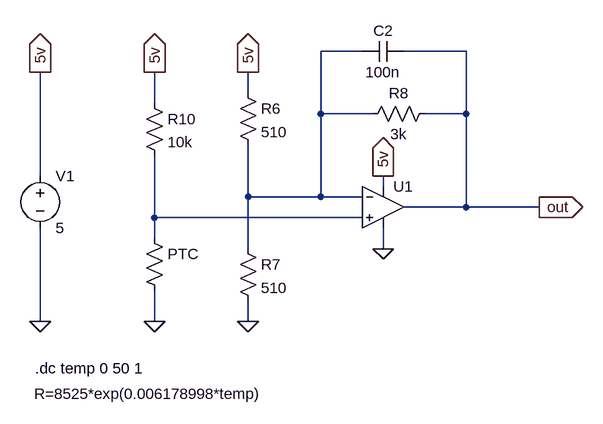
[diagram p0: schematic PTC.asc]
PTC.asc, the LTspice schematic file:
Version 4
SHEET 1 1456 1080
WIRE 1088 -64 1024 -64
WIRE 1248 -64 1152 -64
WIRE 912 0 912 -32
WIRE 768 16 768 -32
WIRE 1024 32 1024 -64
WIRE 1104 32 1024 32
WIRE 1248 32 1248 -64
WIRE 1248 32 1184 32
WIRE 592 128 592 -32
WIRE 1120 144 1120 128
WIRE 912 160 912 80
WIRE 1024 160 1024 32
WIRE 1024 160 912 160
WIRE 1088 160 1024 160
WIRE 1248 176 1248 32
WIRE 1248 176 1152 176
WIRE 1360 176 1248 176
WIRE 768 192 768 96
WIRE 1088 192 768 192
WIRE 768 224 768 192
WIRE 912 240 912 160
WIRE 1120 240 1120 208
WIRE 592 352 592 208
WIRE 768 352 768 304
WIRE 912 352 912 320
FLAG 592 352 0
FLAG 592 -32 5v
IOPIN 592 -32 Out
FLAG 1120 240 0
FLAG 1120 128 5v
IOPIN 1120 128 Out
FLAG 912 352 0
FLAG 768 352 0
FLAG 1360 176 out
IOPIN 1360 176 Out
FLAG 768 -32 5v
IOPIN 768 -32 Out
FLAG 912 -32 5v
IOPIN 912 -32 Out
SYMBOL voltage 592 112 R0
WINDOW 123 0 0 Left 0
WINDOW 39 0 0 Left 0
SYMATTR InstName V1
SYMATTR Value 5
SYMBOL res 896 -16 R0
SYMATTR InstName R6
SYMATTR Value 510
SYMBOL res 896 224 R0
SYMATTR InstName R7
SYMATTR Value 510
SYMBOL res 1200 16 R90
WINDOW 0 0 56 VBottom 2
WINDOW 3 32 56 VTop 2
SYMATTR InstName R8
SYMATTR Value 3k
SYMBOL res 752 208 R0
WINDOW 3 -169 255 Left 2
SYMATTR Value R=8525*exp(0.006178998*temp)
SYMATTR InstName PTC
SYMBOL res 752 0 R0
SYMATTR InstName R10
SYMATTR Value 10k
SYMBOL cap 1152 -80 R90
WINDOW 0 0 32 VBottom 2
WINDOW 3 32 32 VTop 2
SYMATTR InstName C2
SYMATTR Value 100n
SYMBOL OpAmps\\UniversalOpAmp 1120 176 R0
SYMATTR InstName U1
TEXT 584 424 Left 2 !.dc temp 0 50 1

The netlist it stands for:
* PTC.asc
V1 5v 0 5
R6 5v N001 510
R7 N001 0 510
R8 out N001 3k
R§PTC N002 0 R=8525*exp(0.006178998*temp)
R10 5v N002 10k
C2 out N001 100n
XU1 N002 N001 5v 0 out level1 Avol=1Meg GBW=10Meg Vos=0 En=0 Enk=0 In=0 Ink=0 Rin=500Meg  ; pins In+ In- V+ V- OUT
.dc temp 0 50 1
.lib UniversalOpAmp1.lib
.backanno
.end